# EAGLE design programer2 (EAGLE 5.06)

## Sheet 1 of 2
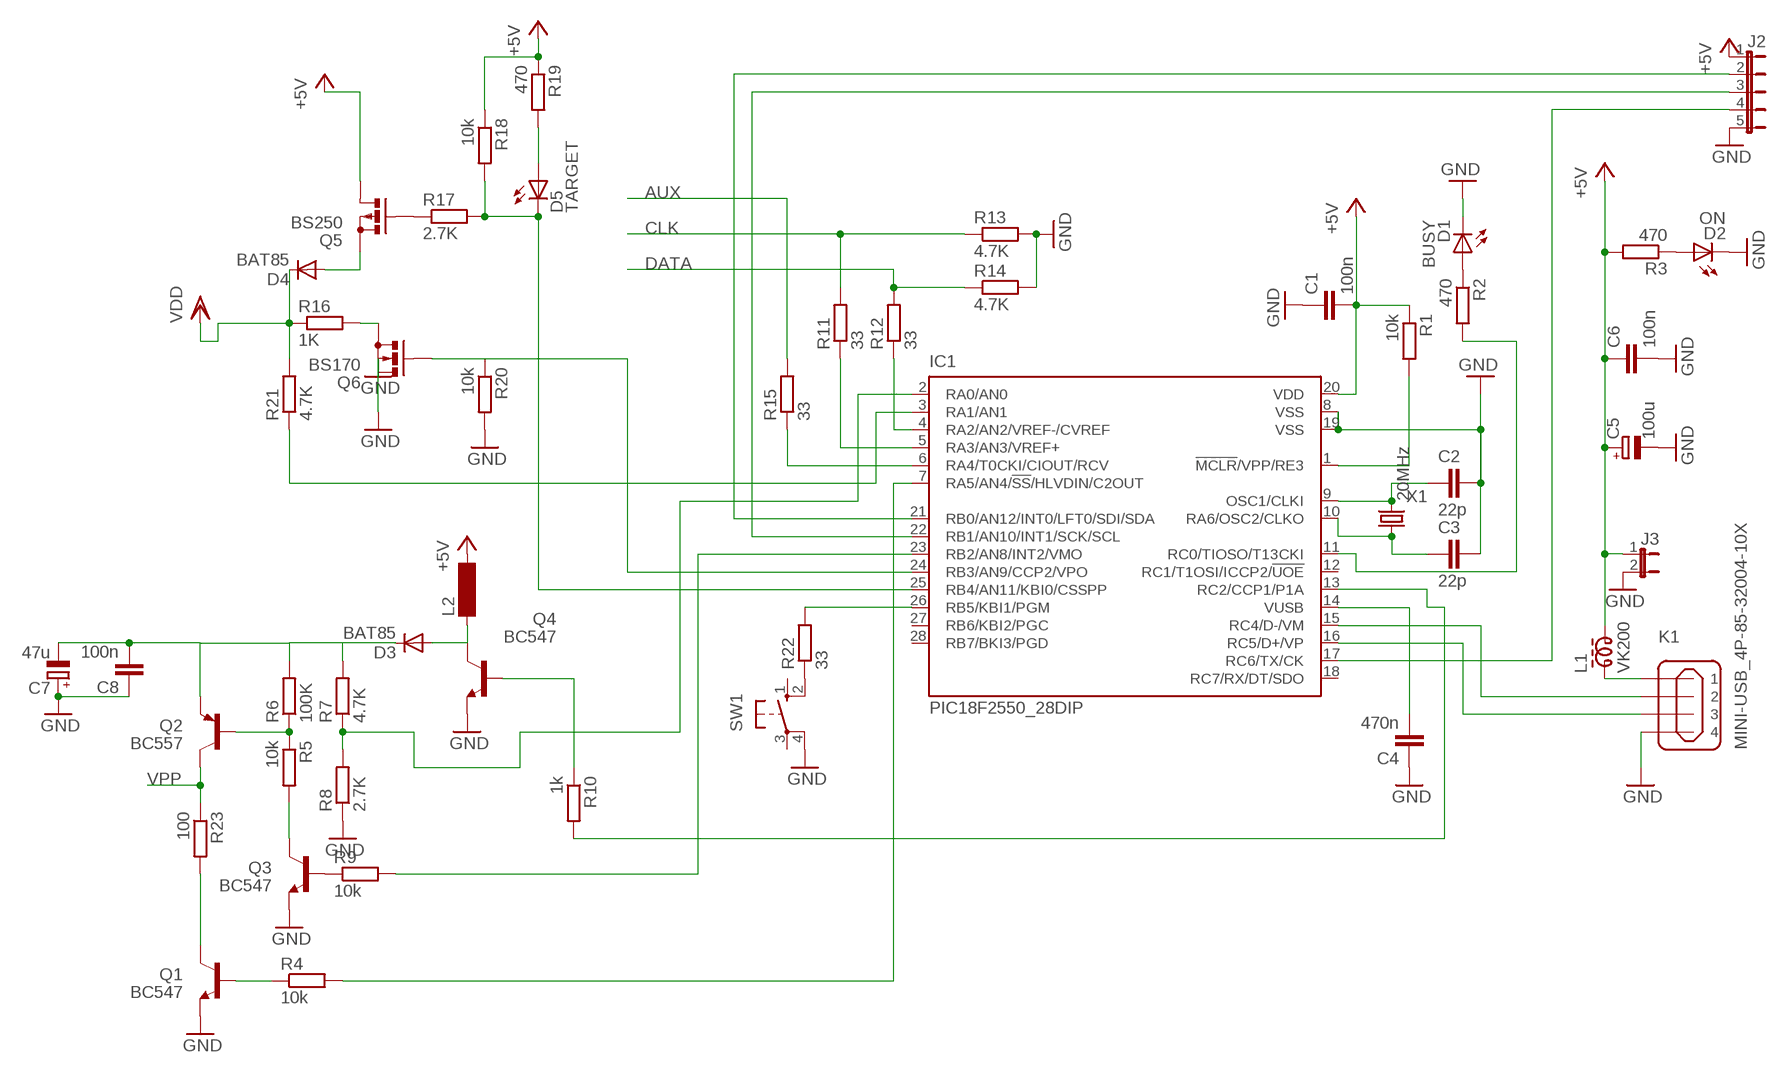
[diagram p0: schematic, sheet 1]

### Parts
C1  100n  C-EU025-025X050  [C025-025X050]
C2  22p  C-EU025-025X050  [C025-025X050]
C3  22p  C-EU025-025X050  [C025-025X050]
C4  470n  C-EU025-025X050  [C025-025X050]
C5  100u  CPOL-EUE2-4  [E2-4]
C6  100n  C-EU025-025X050  [C025-025X050]
C7  47u  CPOL-EUE2-4  [E2-4]
C8  100n  C-EU025-025X050  [C025-025X050]
D1  BUSY  LED3MM  [LED3MM]
D2  ON  LED3MM  [LED3MM]
D3  BAT85  BAT81  [DO34-7]
D4  BAT85  BAT81  [DO34-7]
D5  TARGET  LED3MM  [LED3MM]
IC1  PIC18F2550_28DIP  [DIL28-3]
J2  JP5L  [JP5L]
J3  JP1E  [JP1]
K1  MINI-USB_4P-85-32004-10X  [85-32004-10X]
L1  VK200  ZD60820511  [ZD6-2W]
L2  SD75  [SD75]
Q1  BC547  [TO92]
Q2  BC557  [TO92]
Q3  BC547  [TO92]
Q4  BC547  [TO92]
Q5  BS250  [SOT54E]
Q6  BS170  [SOT54E]
R1  10k  R-EU_0204/5  [0204/5]
R2  470  R-EU_0204/5  [0204/5]
R3  470  R-EU_0204/5  [0204/5]
R4  10k  R-EU_0204/5  [0204/5]
R5  10k  R-EU_0204/5  [0204/5]
R6  100K  R-EU_0204/5  [0204/5]
R7  4.7K  R-EU_0204/5  [0204/5]
R8  2.7K  R-EU_0204/5  [0204/5]
R9  10k  R-EU_0204/5  [0204/5]
R10  1k  R-EU_0204/5  [0204/5]
R11  33  R-EU_0204/5  [0204/5]
R12  33  R-EU_0204/5  [0204/5]
R13  4.7K  R-EU_0204/5  [0204/5]
R14  4.7K  R-EU_0204/5  [0204/5]
R15  33  R-EU_0204/5  [0204/5]
R16  1K  R-EU_0204/5  [0204/5]
R17  2.7K  R-EU_0204/5  [0204/5]
R18  10k  R-EU_0204/5  [0204/5]
R19  470  R-EU_0204/5  [0204/5]
R20  10k  R-EU_0204/5  [0204/5]
R21  4.7K  R-EU_0204/5  [0204/5]
R22  33  R-EU_0204/5  [0204/5]
R23  100  R-EU_0204/5  [0204/5]
SW1  10-XX  [B3F-10XX]
X1  20MHz  CRYSTALHC18U-V  [HC18U-V]

### Nets
+5V: C1.2 C5.+ C6.1 IC1.20(VDD) J2.1 J3.1 L1.2 L2.2 Q5.D R1.1 R3.2 R18.1 R19.1
AUX: R15.2 ; also sheet 2
CLK: R11.2 R13.1 ; also sheet 2
DATA: D5.K(C) IC1.25(RB4/AN11/KBI0/CSSPP) R12.2 R14.1 R17.2 R18.2 ; also sheet 2
GND: C1.1 C2.1 C3.1 C4.1 C5.- C6.2 C7.+ C8.1 D1.K(C) D2.K(C) IC1.8(VSS) IC1.19(VSS) J2.5 J3.2 K1.4 Q1.1(E) Q3.1(E) Q4.1(E) Q6.D R8.1 R13.2 R14.2 R20.2 SW1.4(P1) ; also sheet 2
K1: K1.1 L1.1
N$1: C4.2 IC1.14(VUSB)
N$2: D2.A R3.1
N$3: C2.2 IC1.9(OSC1/CLKI) X1.2
N$4: C3.2 IC1.10(RA6/OSC2/CLKO) X1.1
N$5: IC1.1(!MCLR!/VPP/RE3) R1.2
N$6: D1.A R2.1
N$7: IC1.11(RC0/TIOSO/T13CKI) R2.2
N$8: IC1.15(RC4/D-/VM) K1.2
N$9: IC1.16(RC5/D+/VP) K1.3
N$10: IC1.21(RB0/AN12/INT0/LFT0/SDI/SDA) J2.2
N$11: IC1.22(RB1/AN10/INT1/SCK/SCL) J2.3
N$12: IC1.17(RC6/TX/CK) J2.4
N$13: Q5.G R17.1
N$14: IC1.7(RA5/AN4/!SS!/HLVDIN/C2OUT) R4.2
N$15: Q4.2(B) R10.1
N$16: IC1.4(RA2/AN2/VREF-/CVREF) R12.1
N$17: IC1.5(RA3/AN3/VREF+) R11.1
N$18: IC1.6(RA4/T0CKI/CIOUT/RCV) R15.1
N$19: IC1.26(RB5/KBI1/PGM) R22.2
N$20: R22.1 SW1.2(S1)
N$21: IC1.13(RC2/CCP1/P1A) R10.2
N$22: D5.A R19.2
N$23: IC1.24(RB3/AN9/CCP2/VPO) Q6.G R20.1
N$24: Q6.S R16.2
N$25: D4.A Q5.S
N$26: IC1.3(RA1/AN1) R21.1
N$27: Q2.2(B) R5.1 R6.1
N$28: IC1.2(RA0/AN0) R7.1 R8.2
N$29: Q3.3(C) R5.2
N$30: D3.A L2.1 Q4.3(C)
N$31: C7.- C8.2 D3.C Q2.1(E) R6.2 R7.2
N$32: Q3.2(B) R9.1
N$33: Q1.2(B) R4.1
N$34: IC1.23(RB2/AN8/INT2/VMO) R9.2
N$35: Q1.3(C) R23.2
VDD: D4.C R16.1 R21.2 ; also sheet 2
VPP: Q2.3(C) R23.1 ; also sheet 2
Unconnected: IC1.12(RC1/T1OSI/ICCP2/!UOE) IC1.18(RC7/RX/DT/SDO) IC1.27(RB6/KBI2/PGC) IC1.28(RB7/BKI3/PGD) SW1.1(S) SW1.3(P)

## Sheet 2 of 2
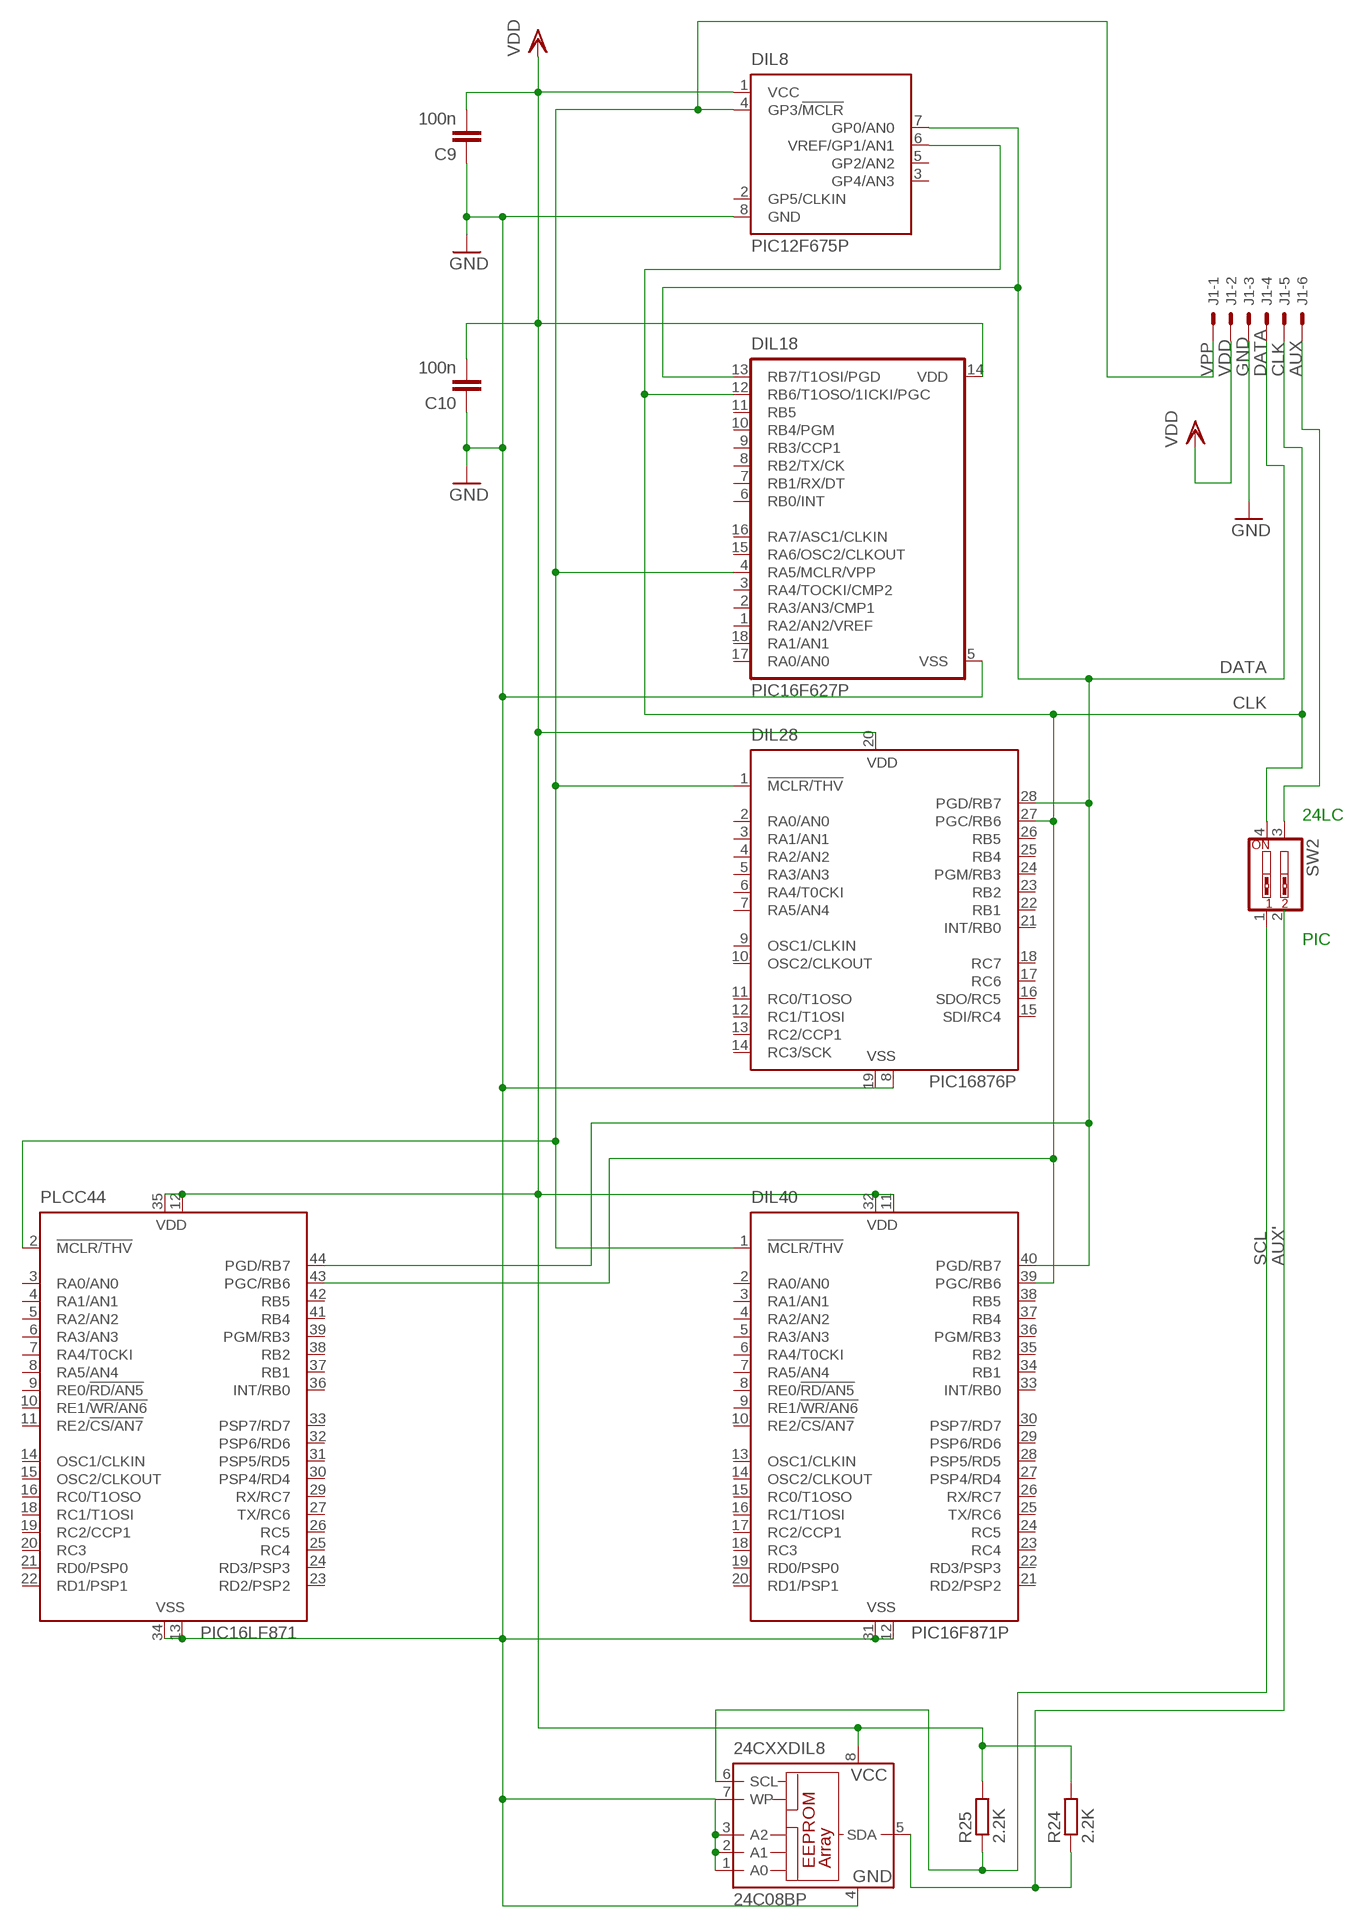
[diagram p1: schematic, sheet 2]

### Parts
24CXXDIL8  24C08BP  [DIL8]
C9  100n  C-EU025-025X050  [C025-025X050]
C10  100n  C-EU025-025X050  [C025-025X050]
DIL8  PIC12F675P  [DIL8]
DIL18  PIC16F627P  [DIL18]
DIL28  PIC16876P  [DIL28-3]
DIL40  PIC16F871P  [DIL40]
J1  22-23-2061  [22-23-2061]
PLCC44  PIC16LF871  [SOCKET44]
R24  2.2K  R-EU_0204/5  [0204/5]
R25  2.2K  R-EU_0204/5  [0204/5]
SW2  SW_DIP-2  [EDG-02]

### Nets
AUX: J1.6 SW2.3 ; also sheet 1
AUX': 24CXXDIL8.5(SDA) R24.1 SW2.2
CLK: DIL8.6(VREF/GP1/AN1) DIL18.12(RB6/T1OSO/1ICKI/PGC) DIL28.27(PGC/RB6) DIL40.39(PGC/RB6) J1.5 PLCC44.43(PGC/RB6) SW2.4 ; also sheet 1
DATA: DIL8.7(GP0/AN0) DIL18.13(RB7/T1OSI/PGD) DIL28.28(PGD/RB7) DIL40.40(PGD/RB7) J1.4 PLCC44.44(PGD/RB7) ; also sheet 1
GND: 24CXXDIL8.1(A0) 24CXXDIL8.2(A1) 24CXXDIL8.3(A2) 24CXXDIL8.4(GND) 24CXXDIL8.7(WP) C9.1 C10.1 DIL8.8(GND) DIL18.5(VSS) DIL28.8(VSS) DIL28.19(VSS) DIL40.12(VSS) DIL40.31(VSS) J1.3 PLCC44.13(VSS) PLCC44.34(VSS) ; also sheet 1
SCL: 24CXXDIL8.6(SCL) R25.1 SW2.1
VDD: 24CXXDIL8.8(VCC) C9.2 C10.2 DIL8.1(VCC) DIL18.14(VDD) DIL28.20(VDD) DIL40.11(VDD) DIL40.32(VDD) J1.2 PLCC44.12(VDD) PLCC44.35(VDD) R24.2 R25.2 ; also sheet 1
VPP: DIL8.4(GP3/!MCLR) DIL18.4(RA5/MCLR/VPP) DIL28.1(!MCLR/THV) DIL40.1(!MCLR/THV) J1.1 PLCC44.2(!MCLR/THV) ; also sheet 1
Unconnected: DIL8.2(GP5/CLKIN) DIL8.3(GP4/AN3) DIL8.5(GP2/AN2) DIL18.1(RA2/AN2/VREF) DIL18.2(RA3/AN3/CMP1) DIL18.3(RA4/TOCKI/CMP2) DIL18.6(RB0/INT) DIL18.7(RB1/RX/DT) DIL18.8(RB2/TX/CK) DIL18.9(RB3/CCP1) DIL18.10(RB4/PGM) DIL18.11(RB5) DIL18.15(RA6/OSC2/CLKOUT) DIL18.16(RA7/ASC1/CLKIN) DIL18.17(RA0/AN0) DIL18.18(RA1/AN1) DIL28.2(RA0/AN0) DIL28.3(RA1/AN1) DIL28.4(RA2/AN2) DIL28.5(RA3/AN3) DIL28.6(RA4/T0CKI) DIL28.7(RA5/AN4) DIL28.9(OSC1/CLKIN) DIL28.10(OSC2/CLKOUT) DIL28.11(RC0/T1OSO) DIL28.12(RC1/T1OSI) DIL28.13(RC2/CCP1) DIL28.14(RC3/SCK) DIL28.15(SDI/RC4) DIL28.16(SDO/RC5) DIL28.17(RC6) DIL28.18(RC7) DIL28.21(INT/RB0) DIL28.22(RB1) DIL28.23(RB2) DIL28.24(PGM/RB3) DIL28.25(RB4) DIL28.26(RB5) DIL40.2(RA0/AN0) DIL40.3(RA1/AN1) DIL40.4(RA2/AN2) DIL40.5(RA3/AN3) DIL40.6(RA4/T0CKI) DIL40.7(RA5/AN4) DIL40.8(RE0/!RD/AN5) DIL40.9(RE1/!WR/AN6) DIL40.10(RE2/!CS/AN7) DIL40.13(OSC1/CLKIN) DIL40.14(OSC2/CLKOUT) DIL40.15(RC0/T1OSO) DIL40.16(RC1/T1OSI) DIL40.17(RC2/CCP1) DIL40.18(RC3) DIL40.19(RD0/PSP0) DIL40.20(RD1/PSP1) DIL40.21(RD2/PSP2) DIL40.22(RD3/PSP3) DIL40.23(RC4) DIL40.24(RC5) DIL40.25(TX/RC6) DIL40.26(RX/RC7) DIL40.27(PSP4/RD4) DIL40.28(PSP5/RD5) DIL40.29(PSP6/RD6) DIL40.30(PSP7/RD7) DIL40.33(INT/RB0) DIL40.34(RB1) DIL40.35(RB2) DIL40.36(PGM/RB3) DIL40.37(RB4) DIL40.38(RB5) PLCC44.3(RA0/AN0) PLCC44.4(RA1/AN1) PLCC44.5(RA2/AN2) PLCC44.6(RA3/AN3) PLCC44.7(RA4/T0CKI) PLCC44.8(RA5/AN4) PLCC44.9(RE0/!RD/AN5) PLCC44.10(RE1/!WR/AN6) PLCC44.11(RE2/!CS/AN7) PLCC44.14(OSC1/CLKIN) PLCC44.15(OSC2/CLKOUT) PLCC44.16(RC0/T1OSO) PLCC44.18(RC1/T1OSI) PLCC44.19(RC2/CCP1) PLCC44.20(RC3) PLCC44.21(RD0/PSP0) PLCC44.22(RD1/PSP1) PLCC44.23(RD2/PSP2) PLCC44.24(RD3/PSP3) PLCC44.25(RC4) PLCC44.26(RC5) PLCC44.27(TX/RC6) PLCC44.29(RX/RC7) PLCC44.30(PSP4/RD4) PLCC44.31(PSP5/RD5) PLCC44.32(PSP6/RD6) PLCC44.33(PSP7/RD7) PLCC44.36(INT/RB0) PLCC44.37(RB1) PLCC44.38(RB2) PLCC44.39(PGM/RB3) PLCC44.41(RB4) PLCC44.42(RB5)

### Notes on the sheet
- 24LC
- PIC

## Library data of the parts
24CXXDIL8 = microchip-6:24*: Serial EEPROM I2C
C1-C4 C6 C8-C10 = rcl:C-EU: CAPACITOR, European symbol
C5 C7 = rcl:CPOL-EU: POLARIZED CAPACITOR, European symbol
D1 D2 D5 = led:LED: LED OSRAM: - CHIPLED LG R971, LG N971, LY N971, LG Q971, LY Q971, LO R971, LY R971 LH N974, LH R974 LS Q976, LO Q976, LY Q976 LO Q996 - Hyper CHIPLED LW Q18S LB Q993, LB Q99A, LB R99A - SideLED LS A670, LO A670, LY A670, LG A670, LP A670 LB A673, LV A673, LT A673, LW A673 LH A674 LY A675 LS A676, LA A676, LO A676, LY A676, LW A676 LS A679, LY A679, LG A679 - Hyper Micro SIDELED® LS Y876, LA Y876, LO Y876, LY Y876 LT Y87S - SmartLED LW L88C, LW L88S LB L89C, LB L89S, LG L890 LS L89K, LO L89K, LY L89K LS L896, LA L896, LO L896, LY L896 - TOPLED LS T670, LO T670, LY T670, LG T670, LP T670 LSG T670, LSP T670, LSY T670, LOP T670, LYG T670 LG T671, LOG T671, LSG T671 LB T673, LV T673, LT T673, LW T673 LH T674 LS T676, LA T676, LO T676, LY T676, LB T676, LH T676, LSB T676, LW T676 LB T67C, LV T67C, LT T67C, LS T67K, LO T67K, LY T67K, LW E67C LS E67B, LA E67B, LO E67B, LY E67B, LB E67C, LV E67C, LT E67C LW T67C LS T679, LY T679, LG T679 LS T770, LO T770, LY T770, LG T770, LP T770 LB T773, LV T773, LT T773, LW T773 LH T774 LS E675, LA E675, LY E675, LS T675 LS T776, LA T776, LO T776, LY T776, LB T776 LHGB T686 LT T68C, LB T68C - Hyper Mini TOPLED® LB M676 - Mini TOPLED Santana® LG M470 LS M47K, LO M47K, LY M47K Source: http://www.osram.convergy.de LUXEON: - LUMILED® LXK2-PW12-R00, LXK2-PW12-S00, LXK2-PW14-U00, LXK2-PW14-V00 LXK2-PM12-R00, LXK2-PM12-S00, LXK2-PM14-U00 LXK2-PE12-Q00, LXK2-PE12-R00, LXK2-PE12-S00, LXK2-PE14-T00, LXK2-PE14-U00 LXK2-PB12-K00, LXK2-PB12-L00, LXK2-PB12-M00, LXK2-PB14-N00, LXK2-PB14-P00, LXK2-PB14-Q00 LXK2-PR12-L00, LXK2-PR12-M00, LXK2-PR14-Q00, LXK2-PR14-R00 LXK2-PD12-Q00, LXK2-PD12-R00, LXK2-PD12-S00 LXK2-PH12-R00, LXK2-PH12-S00 LXK2-PL12-P00, LXK2-PL12-Q00, LXK2-PL12-R00 Source: www.luxeon.com KINGBRIGHT: KA-3528ASYC Source: www.kingbright.com
D3 D4 = diode:BAT81: DIODE barrier diode
DIL8 = microchip-6:PIC12F675: 8-Pin FLASH-Based 8-Bit CMOS Microcontroller Precision Internal 4 MHz oscillator factory calibrated to ±1% Low Power Features: Standby Current: - 1 nA @ 2.0V, typical Operating Current: - 8.5µA @ 32 kHz, 2.0V, typical - 100µA @ 1 MHz, 2.0V, typical Watchdog Timer Current: - 300 nA @ 2.0V, typical Timer1 oscillator current: - 4µA @ 32 kHz, 2.0V, typical Analog-to-Digital Converter module: - 10-bit resolution - Programmable 4-channel input - Voltage reference input Source: http://www.microchip.com .. 41190E.pdf
DIL18 = microchip-6:PIC16*F62: FLASH-Based 8-Bit CMOS Microcontroller Source: http://ww1.microchip.com/downloads/en/DeviceDoc/40300C.pdf
DIL28 = microchip-6:PIC16*876: MICROCONTROLLER flash type
DIL40 PLCC44 = microchip-6:PIC16*871: MICROCONTROLLER flash type
IC1 = microchip-6:PIC18F2*_28: USB Microcontrollers with nanoWatt Technology High-Performance, Enhanced Flash, 28/40/44-Pin, Source: http://ww1.microchip.com/downloads/en/devicedoc/39632c.pdf
J1 = con-molex:22-23-2061: .100" (2.54mm) Center Header - 6 Pin
J2 = jumper:JP5L
J3 = jumper:JP1E: JUMPER
K1 = con-cypressindustries:MINI-USB_4P-: MINI USB 4 Pol. Source: www.cypressindustries.com
L1 = inductor-neosid:ZD60820511: WIDE-BAND CHOKE 2 windings
L2 = inductor-neosid:SD75: INDUCTOR nominal inductance, E12
Q1 Q3 Q4 = transistor:BC547: NPN TRANSISTOR
Q2 = transistor-pnp:BC557: PNP Transistor
Q5 = transistor-small-signal:BS250: P-CHANNEL MOS FET
Q6 = transistor-small-signal:BS170: N-CHANNEL MOS FET
R1-R25 = rcl:R-EU_: RESISTOR, European symbol
SW1 = switch-omron:10-XX: OMRON SWITCH
SW2 = special:SW_DIP-2: DIP SWITCH
X1 = crystal:CRYSTAL: CRYSTAL

## Board
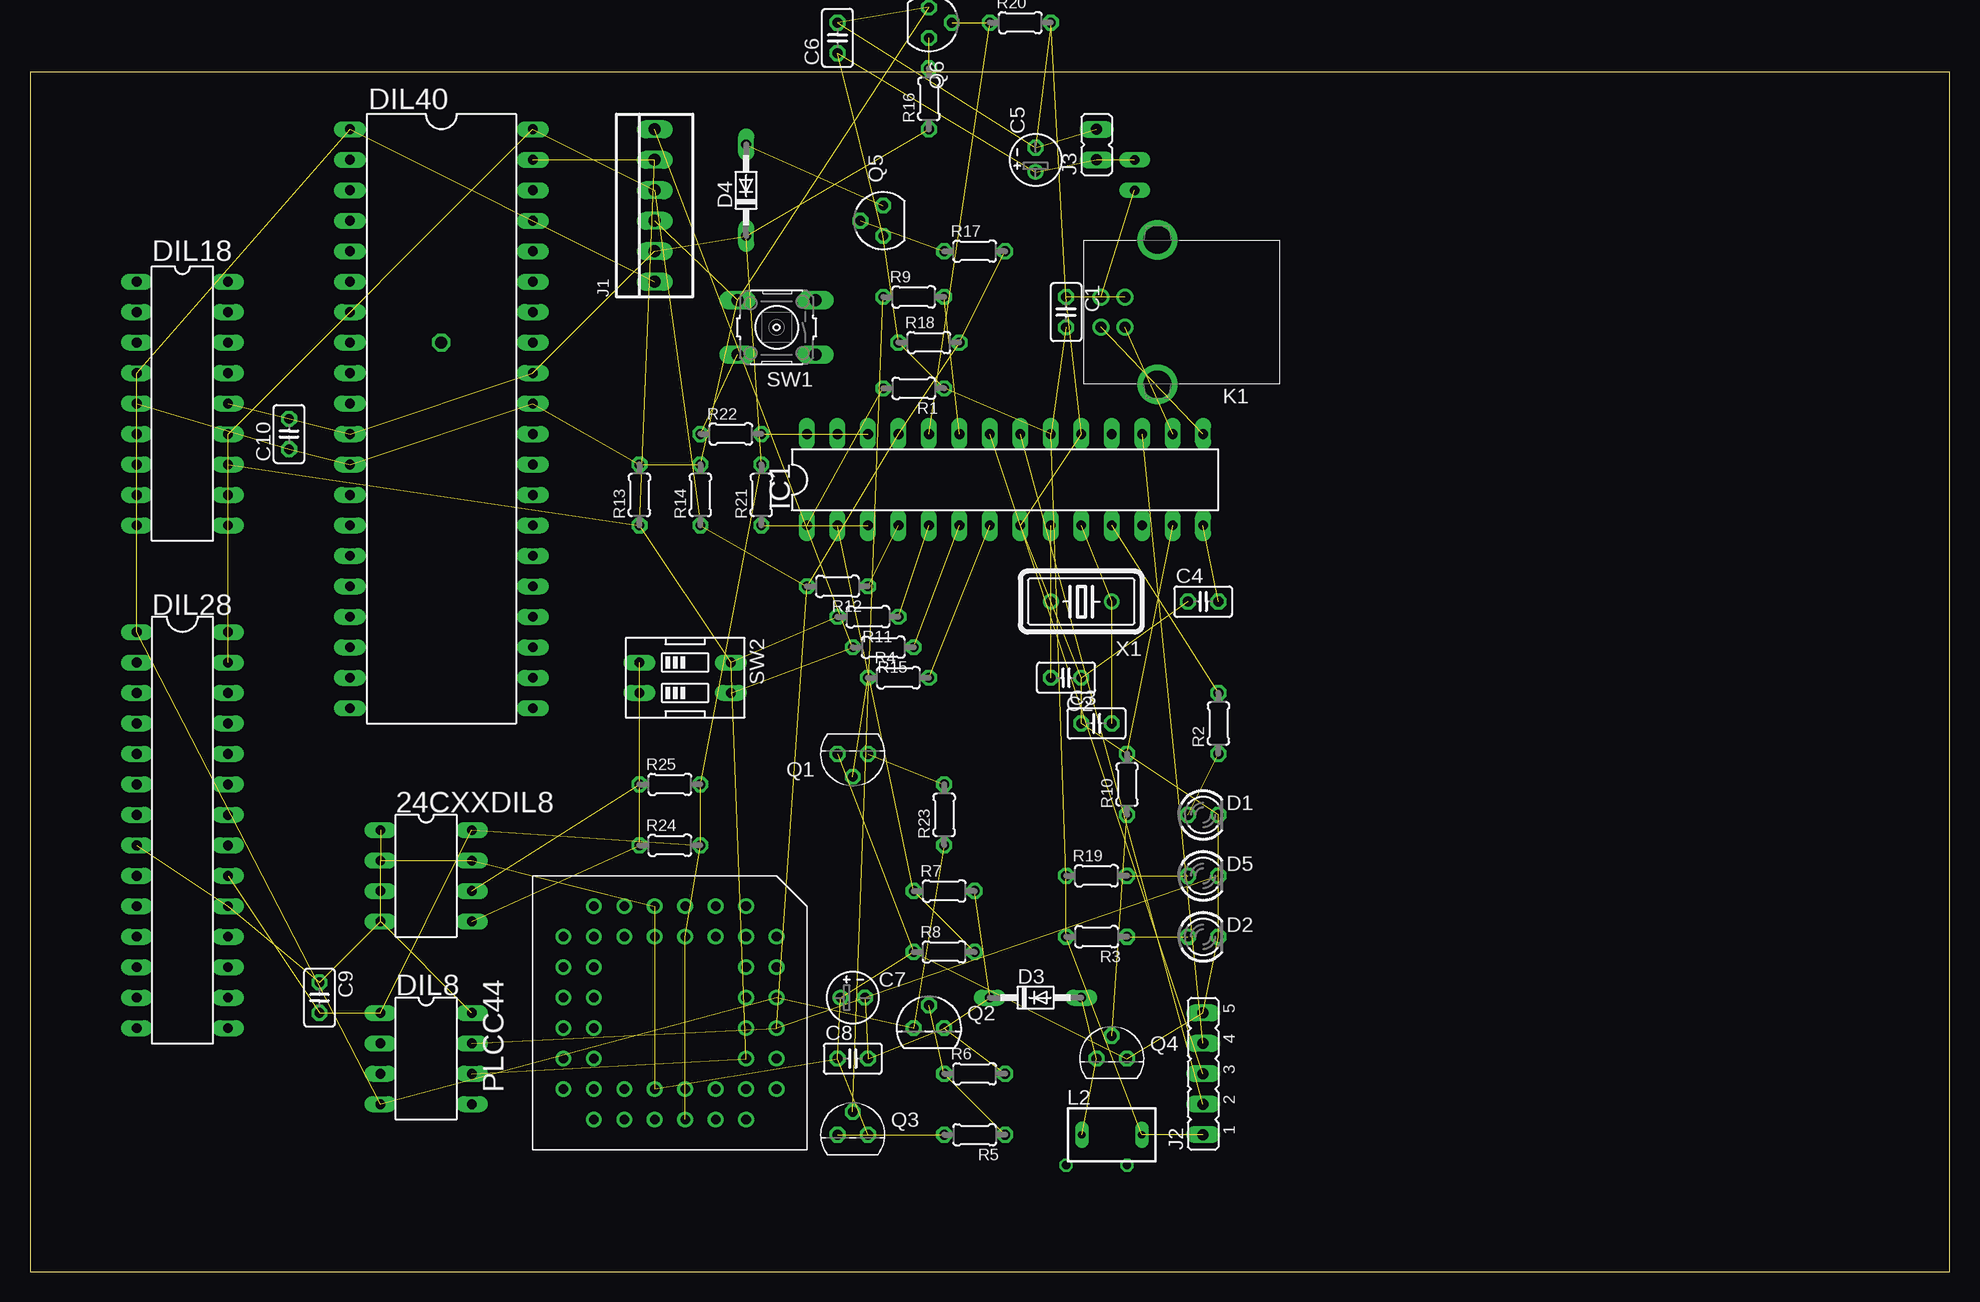
[diagram p2: board, top side]
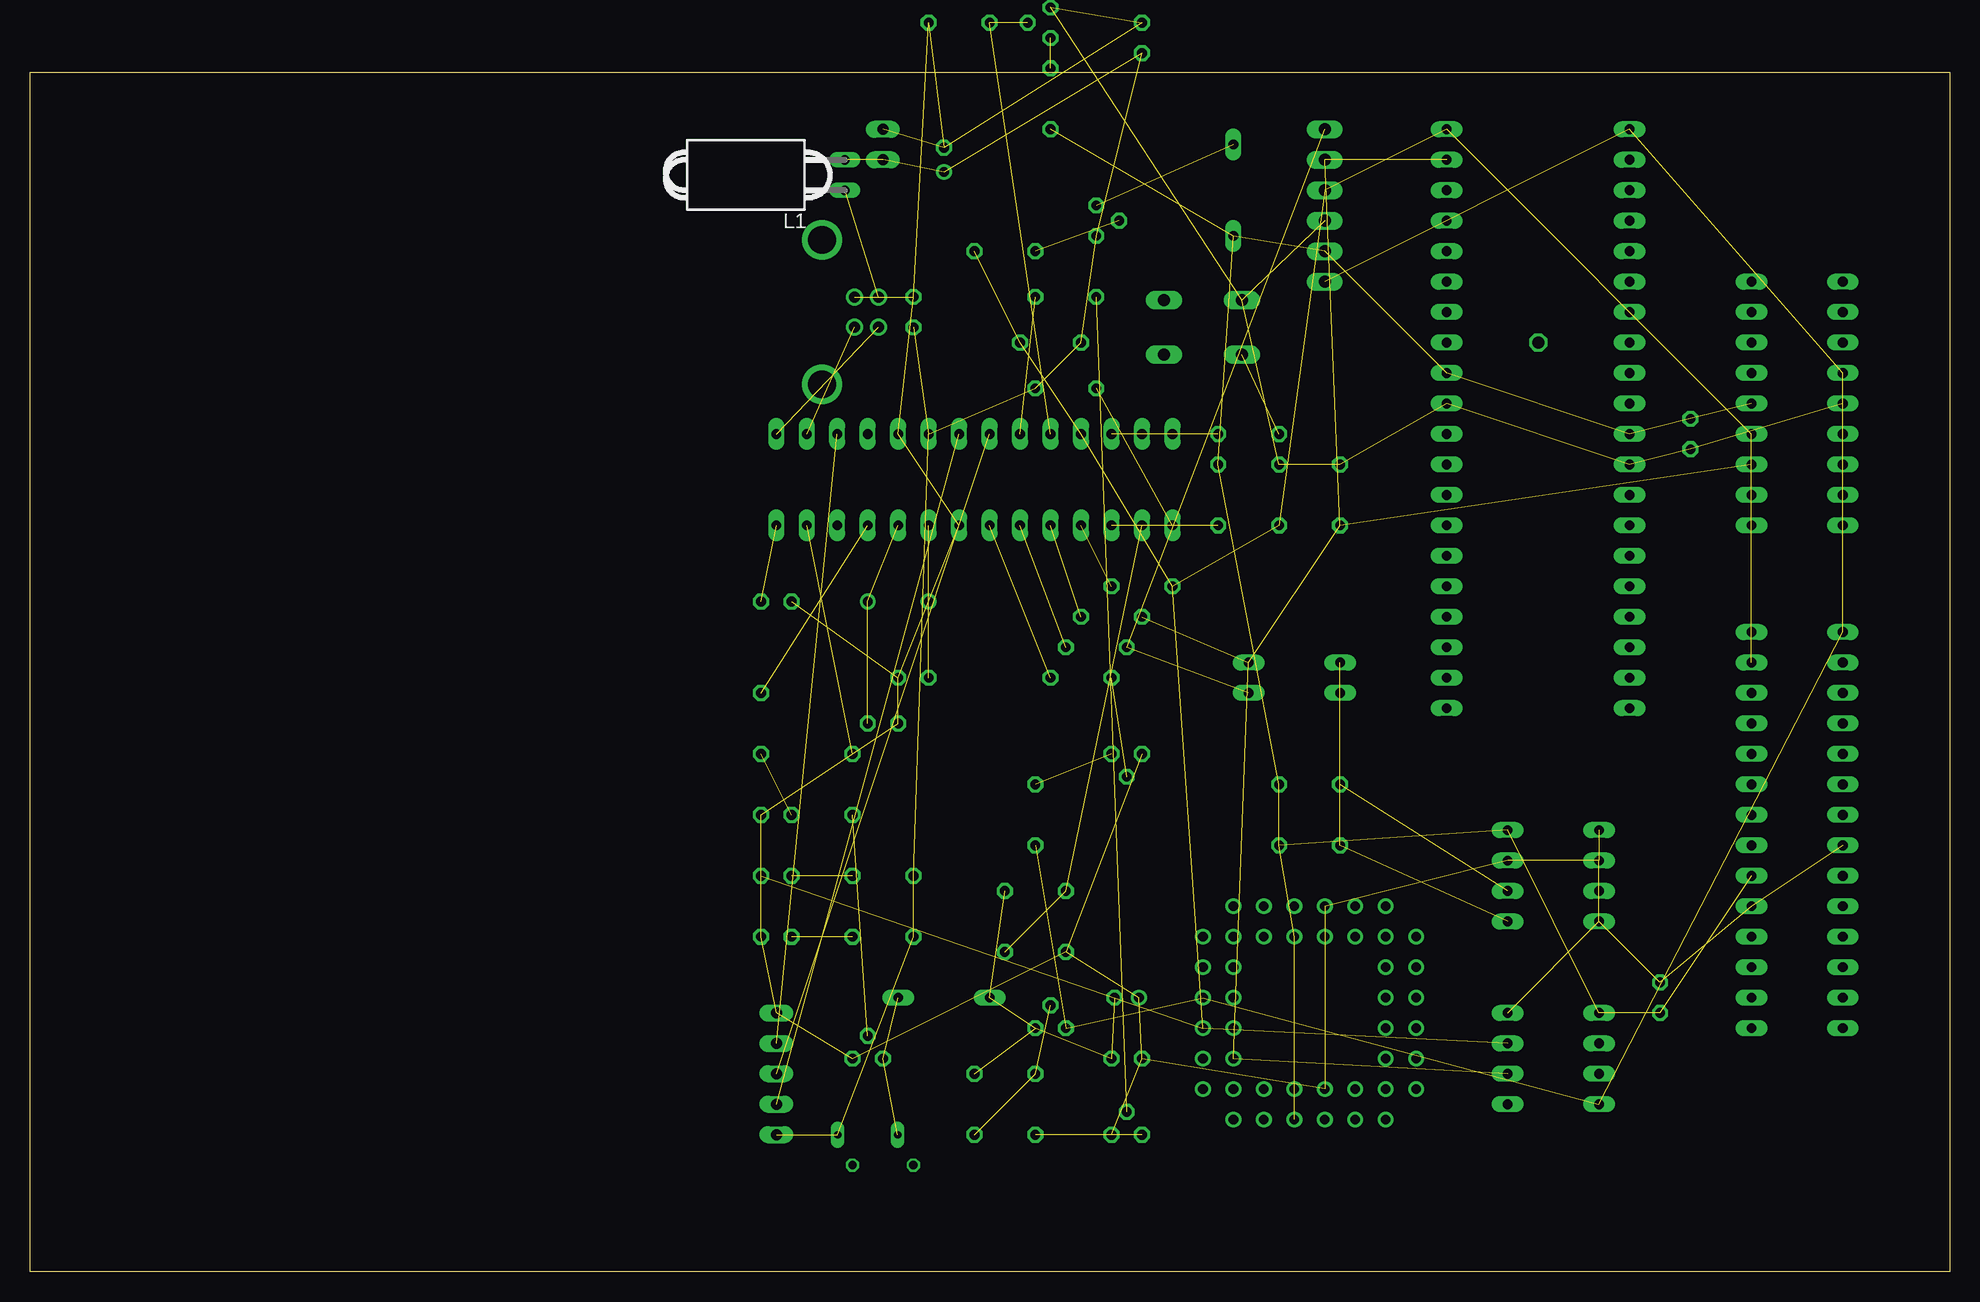
[diagram p3: board, bottom side, seen from below]

Size 160 x 100 mm. Coordinates in mm from the lower left corner, seen from the top.
Outline: 0,0 160,0 160,100 0,100 0,0
Copper layers (1*16): Top 0.035mm / dielectric 1.5mm / Bottom 0.035mm
Design rules "default": minimum track width 10mil, minimum drill 24mil, track to track 8mil, track to pad 8mil, pad to pad 8mil, via to via 8mil, smd to smd 8mil, copper to edge 40mil, drill to drill 8mil, minimum pad ring 10mil, minimum via ring 8mil, stop-mask expansion 4mil, vias tented up to drill 0mil, thermal gap 10mil

### Footprints (pad centres in the part's own frame; a part is rotated, then mirrored left to right if it is on the bottom)
DIL8 = drill 0.813 long: 1 -3.81,-3.81; 2 -1.27,-3.81; 3 1.27,-3.81; 4 3.81,-3.81; 5 3.81,3.81; 6 1.27,3.81; 7 -1.27,3.81; 8 -3.81,3.81
C025-025X050 = drill 0.813 octagon: 1 -1.27,0; 2 1.27,0
E2-4 = drill 0.813 pad 1.27 round: + -1.016,0 | drill 0.813 pad 1.27 octagon: - 1.016,0
LED3MM = drill 0.813 octagon: A -1.27,0; K 1.27,0
DO34-7 = drill 0.813 long: A 3.81,0; C -3.81,0
DIL18 = drill 0.813 long: 1 -10.16,-3.81; 2 -7.62,-3.81; 3 -5.08,-3.81; 4 -2.54,-3.81; 5 0,-3.81; 6 2.54,-3.81; 7 5.08,-3.81; 8 7.62,-3.81; 9 10.16,-3.81; 10 10.16,3.81; 11 7.62,3.81; 12 5.08,3.81; 13 2.54,3.81; 14 0,3.81; 15 -2.54,3.81; 16 -5.08,3.81; 17 -7.62,3.81; 18 -10.16,3.81
DIL28-3 = drill 0.813 long: 1 -16.51,-3.81; 2 -13.97,-3.81; 3 -11.43,-3.81; 4 -8.89,-3.81; 5 -6.35,-3.81; 6 -3.81,-3.81; 7 -1.27,-3.81; 8 1.27,-3.81; 9 3.81,-3.81; 10 6.35,-3.81; 11 8.89,-3.81; 12 11.43,-3.81; 13 13.97,-3.81; 14 16.51,-3.81; 15 16.51,3.81; 16 13.97,3.81; 17 11.43,3.81; 18 8.89,3.81; 19 6.35,3.81; 20 3.81,3.81; 21 1.27,3.81; 22 -1.27,3.81; 23 -3.81,3.81; 24 -6.35,3.81; 25 -8.89,3.81; 26 -11.43,3.81; 27 -13.97,3.81; 28 -16.51,3.81
DIL40 = drill 0.813 long: 1 -24.13,-7.62; 2 -21.59,-7.62; 3 -19.05,-7.62; 4 -16.51,-7.62; 5 -13.97,-7.62; 6 -11.43,-7.62; 7 -8.89,-7.62; 8 -6.35,-7.62; 9 -3.81,-7.62; 10 -1.27,-7.62; 11 1.27,-7.62; 12 3.81,-7.62; 13 6.35,-7.62; 14 8.89,-7.62; 15 11.43,-7.62; 16 13.97,-7.62; 17 16.51,-7.62; 18 19.05,-7.62; 19 21.59,-7.62; 20 24.13,-7.62; 21 24.13,7.62; 22 21.59,7.62; 23 19.05,7.62; 24 16.51,7.62; 25 13.97,7.62; 26 11.43,7.62; 27 8.89,7.62; 28 6.35,7.62; 29 3.81,7.62; 30 1.27,7.62; 31 -1.27,7.62; 32 -3.81,7.62; 33 -6.35,7.62; 34 -8.89,7.62; 35 -11.43,7.62; 36 -13.97,7.62; 37 -16.51,7.62; 38 -19.05,7.62; 39 -21.59,7.62; 40 -24.13,7.62
22-23-2061 = drill 1 long: 1 -6.35,0; 2 -3.81,0; 3 -1.27,0; 4 1.27,0; 5 3.81,0; 6 6.35,0
JP5L = drill 0.914 long: 1 1.27,1.27; 2 3.81,1.27; 3 6.35,1.27; 4 8.89,1.27; 5 11.43,1.27
JP1 = drill 0.914 long: 1 0,-1.27; 2 0,1.27
85-32004-10X = drill 0.92 pad 1.27 round: 1 4.71,-1.25; 2 4.71,1.25; 3 2.71,1.25; 4 2.71,-1.25 | drill 2.3 pad 3 round: M1 0,6.02; M2 0,-6.02
ZD6-2W = drill 0.8 long: 1 -8.255,1.27; 2 -8.255,-1.27
SD75 = drill 0.6 long: 1 -2.5,0; 2 2.5,0
SOCKET44 = drill 0.8 round: 1 -2.54,0; 2 0,-2.54; 3 0,0; 4 2.54,-2.54; 5 2.54,0; 6 5.08,-2.54; 7 7.62,0; 8 5.08,0; 9 7.62,2.54; 10 5.08,2.54; 11 7.62,5.08; 12 5.08,5.08; 13 7.62,7.62; 14 5.08,7.62; 15 7.62,10.16; 16 5.08,10.16; 17 7.62,12.7; 18 5.08,15.24; 19 5.08,12.7; 20 2.54,15.24; 21 2.54,12.7; 22 0,15.24; 23 0,12.7; 24 -2.54,15.24; 25 -2.54,12.7; 26 -5.08,15.24; 27 -5.08,12.7; 28 -7.62,15.24; 29 -10.16,12.7; 30 -7.62,12.7; 31 -10.16,10.16; 32 -7.62,10.16; 33 -10.16,7.62; 34 -7.62,7.62; 35 -10.16,5.08; 36 -7.62,5.08; 37 -10.16,2.54; 38 -7.62,2.54; 39 -10.16,0; 40 -7.62,-2.54; 41 -7.62,0; 42 -5.08,-2.54; 43 -5.08,0; 44 -2.54,-2.54
TO92 = drill 0.813 octagon: 1 1.27,0; 2 0,1.905; 3 -1.27,0
SOT54E = drill 0.813 octagon: D -1.27,0; G 0,1.905; S 1.27,0
0204/5 = drill 0.813 octagon: 1 -2.54,0; 2 2.54,0
B3F-10XX = drill 1.016 long: 1 -3.251,2.261; 2 3.251,2.261; 3 -3.251,-2.261; 4 3.251,-2.261
EDG-02 = drill 0.813 long: 1 -1.27,-3.81; 2 1.27,-3.81; 3 1.27,3.81; 4 -1.27,3.81
HC18U-V = drill 0.813 round: 1 -2.54,0; 2 2.54,0

### Placement (x,y rotation side)
24CXXDIL8  33.02,33.02 270 top
C1  86.36,80.01 270 top
C2  86.36,49.53 180 top
C3  88.9,45.72 0 top
C4  97.79,55.88 0 top
C5  83.82,92.71 90 top
C6  67.31,102.87 90 top
C7  68.58,22.86 0 top
C8  68.58,17.78 0 top
C9  24.13,22.86 270 top
C10  21.59,69.85 90 top
D1  97.79,38.1 0 top
D2  97.79,27.94 0 top
D3  83.82,22.86 0 top
D4  59.69,90.17 90 top
D5  97.79,33.02 0 top
DIL8  33.02,17.78 270 top
DIL18  12.7,72.39 270 top
DIL28  12.7,36.83 270 top
DIL40  34.29,71.12 270 top
IC1  81.28,66.04 0 top
J1  52.07,88.9 90 top
J2  99.06,10.16 90 top
J3  88.9,93.98 0 top
K1  93.98,80.01 180 top
L1  100.33,91.44 180 bottom
L2  90.17,11.43 0 top
PLCC44  59.69,22.86 90 top
Q1  68.58,43.18 180 top
Q2  74.93,20.32 0 top
Q3  68.58,11.43 0 top
Q4  90.17,17.78 0 top
Q5  71.12,87.63 90 top
Q6  74.93,104.14 270 top
R1  73.66,73.66 180 top
R2  99.06,45.72 90 top
R3  88.9,27.94 180 top
R4  72.39,49.53 0 top
R5  78.74,11.43 180 top
R6  78.74,16.51 0 top
R7  76.2,31.75 0 top
R8  76.2,26.67 0 top
R9  73.66,81.28 0 top
R10  91.44,40.64 90 top
R11  69.85,54.61 180 top
R12  67.31,57.15 180 top
R13  50.8,64.77 90 top
R14  55.88,64.77 90 top
R15  71.12,52.07 180 top
R16  74.93,97.79 90 top
R17  78.74,85.09 0 top
R18  74.93,77.47 0 top
R19  88.9,33.02 0 top
R20  82.55,104.14 0 top  (outside the outline)
R21  60.96,64.77 90 top
R22  58.42,69.85 0 top
R23  76.2,38.1 90 top
R24  53.34,35.56 0 top
R25  53.34,40.64 0 top
SW1  62.23,78.74 180 top
SW2  54.61,49.53 270 top
X1  87.63,55.88 180 top

### Tracks (layer width: path | path; a pad name or v marks a point on that pad's centre or on a via)
+5V  (12 unrouted)
AUX  (2 unrouted)
AUX'  (2 unrouted)
CLK  (8 unrouted)
DATA  (11 unrouted)
GND  (39 unrouted)
K1  (1 unrouted)
N$1  (1 unrouted)
N$2  (1 unrouted)
N$3  (2 unrouted)
N$4  (2 unrouted)
N$5  (1 unrouted)
N$6  (1 unrouted)
N$7  (1 unrouted)
N$8  (1 unrouted)
N$9  (1 unrouted)
N$10  (1 unrouted)
N$11  (1 unrouted)
N$12  (1 unrouted)
N$13  (1 unrouted)
N$14  (1 unrouted)
N$15  (1 unrouted)
N$16  (1 unrouted)
N$17  (1 unrouted)
N$18  (1 unrouted)
N$19  (1 unrouted)
N$20  (1 unrouted)
N$21  (1 unrouted)
N$22  (1 unrouted)
N$23  (2 unrouted)
N$24  (1 unrouted)
N$25  (1 unrouted)
N$26  (1 unrouted)
N$27  (2 unrouted)
N$28  (2 unrouted)
N$29  (1 unrouted)
N$30  (2 unrouted)
N$31  (5 unrouted)
N$32  (1 unrouted)
N$33  (1 unrouted)
N$34  (1 unrouted)
N$35  (1 unrouted)
N$36  (via drill 1)
  other vias: 34.29,77.47
N$37  (via drill 0.7)
  other vias: 86.36,8.89
N$38  (via drill 0.7)
  other vias: 91.44,8.89
SCL  (2 unrouted)
VDD  (15 unrouted)
VPP  (7 unrouted)